# EAGLE design _Inverter16Smd (EAGLE 7.3.0)
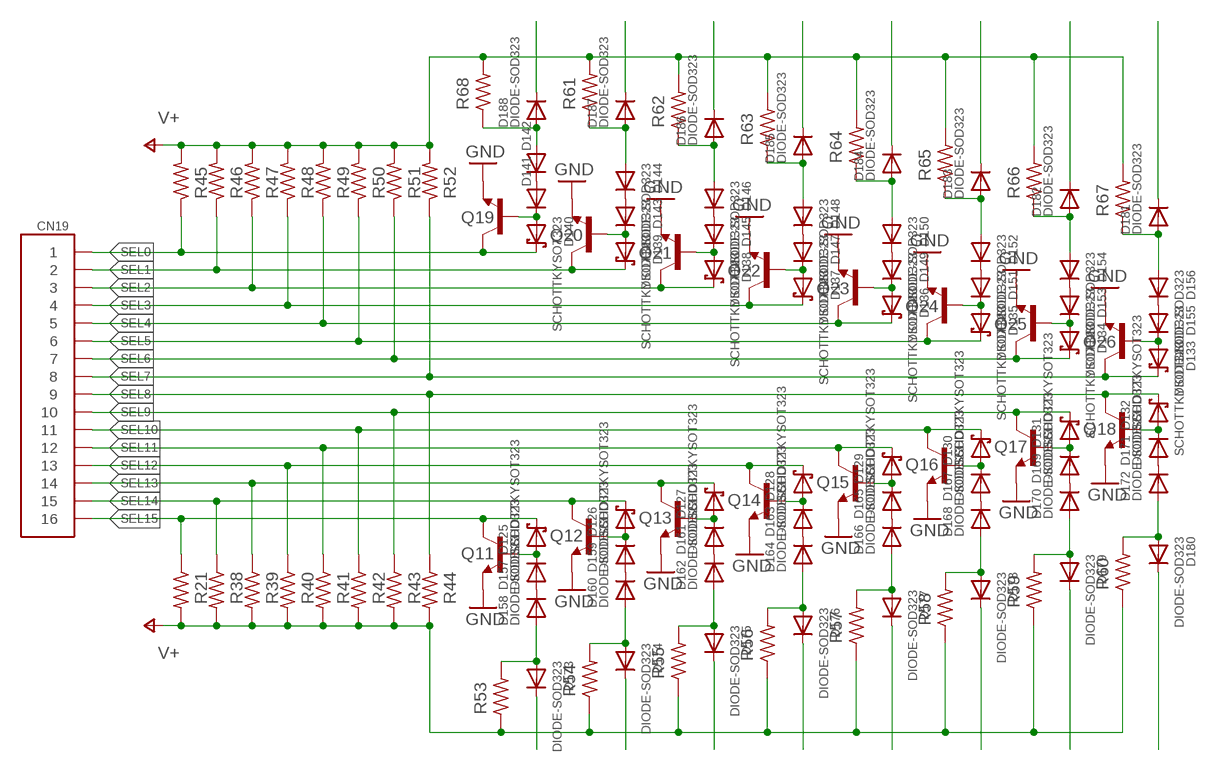
[diagram p0: schematic, sheet 1]

## Parts
CN19  HD16  [HD16]
D125  SCHOTTKYSOT323  [SOT23]
D126  SCHOTTKYSOT323  [SOT23]
D127  SCHOTTKYSOT323  [SOT23]
D128  SCHOTTKYSOT323  [SOT23]
D129  SCHOTTKYSOT323  [SOT23]
D130  SCHOTTKYSOT323  [SOT23]
D131  SCHOTTKYSOT323  [SOT23]
D132  SCHOTTKYSOT323  [SOT23]
D133  SCHOTTKYSOT323  [SOT23]
D134  SCHOTTKYSOT323  [SOT23]
D135  SCHOTTKYSOT323  [SOT23]
D136  SCHOTTKYSOT323  [SOT23]
D137  SCHOTTKYSOT323  [SOT23]
D138  SCHOTTKYSOT323  [SOT23]
D139  SCHOTTKYSOT323  [SOT23]
D140  SCHOTTKYSOT323  [SOT23]
D141  DIODE-SOD323  [SOD323F]
D142  DIODE-SOD323  [SOD323F]
D143  DIODE-SOD323  [SOD323F]
D144  DIODE-SOD323  [SOD323F]
D145  DIODE-SOD323  [SOD323F]
D146  DIODE-SOD323  [SOD323F]
D147  DIODE-SOD323  [SOD323F]
D148  DIODE-SOD323  [SOD323F]
D149  DIODE-SOD323  [SOD323F]
D150  DIODE-SOD323  [SOD323F]
D151  DIODE-SOD323  [SOD323F]
D152  DIODE-SOD323  [SOD323F]
D153  DIODE-SOD323  [SOD323F]
D154  DIODE-SOD323  [SOD323F]
D155  DIODE-SOD323  [SOD323F]
D156  DIODE-SOD323  [SOD323F]
D157  DIODE-SOD323  [SOD323F]
D158  DIODE-SOD323  [SOD323F]
D159  DIODE-SOD323  [SOD323F]
D160  DIODE-SOD323  [SOD323F]
D161  DIODE-SOD323  [SOD323F]
D162  DIODE-SOD323  [SOD323F]
D163  DIODE-SOD323  [SOD323F]
D164  DIODE-SOD323  [SOD323F]
D165  DIODE-SOD323  [SOD323F]
D166  DIODE-SOD323  [SOD323F]
D167  DIODE-SOD323  [SOD323F]
D168  DIODE-SOD323  [SOD323F]
D169  DIODE-SOD323  [SOD323F]
D170  DIODE-SOD323  [SOD323F]
D171  DIODE-SOD323  [SOD323F]
D172  DIODE-SOD323  [SOD323F]
D173  DIODE-SOD323  [SOD323F]
D174  DIODE-SOD323  [SOD323F]
D175  DIODE-SOD323  [SOD323F]
D176  DIODE-SOD323  [SOD323F]
D177  DIODE-SOD323  [SOD323F]
D178  DIODE-SOD323  [SOD323F]
D179  DIODE-SOD323  [SOD323F]
D180  DIODE-SOD323  [SOD323F]
D181  DIODE-SOD323  [SOD323F]
D182  DIODE-SOD323  [SOD323F]
D183  DIODE-SOD323  [SOD323F]
D184  DIODE-SOD323  [SOD323F]
D185  DIODE-SOD323  [SOD323F]
D186  DIODE-SOD323  [SOD323F]
D187  DIODE-SOD323  [SOD323F]
D188  DIODE-SOD323  [SOD323F]
Q11  BC547-SOT23  [SOT23]
Q12  BC547-SOT23  [SOT23]
Q13  BC547-SOT23  [SOT23]
Q14  BC547-SOT23  [SOT23]
Q15  BC547-SOT23  [SOT23]
Q16  BC547-SOT23  [SOT23]
Q17  BC547-SOT23  [SOT23]
Q18  BC547-SOT23  [SOT23]
Q19  BC547-SOT23  [SOT23]
Q20  BC547-SOT23  [SOT23]
Q21  BC547-SOT23  [SOT23]
Q22  BC547-SOT23  [SOT23]
Q23  BC547-SOT23  [SOT23]
Q24  BC547-SOT23  [SOT23]
Q25  BC547-SOT23  [SOT23]
Q26  BC547-SOT23  [SOT23]
R21  R-0805  [R0805]
R38  R-0805  [R0805]
R39  R-0805  [R0805]
R40  R-0805  [R0805]
R41  R-0805  [R0805]
R42  R-0805  [R0805]
R43  R-0805  [R0805]
R44  R-0805  [R0805]
R45  R-0805  [R0805]
R46  R-0805  [R0805]
R47  R-0805  [R0805]
R48  R-0805  [R0805]
R49  R-0805  [R0805]
R50  R-0805  [R0805]
R51  R-0805  [R0805]
R52  R-0805  [R0805]
R53  R-0805  [R0805]
R54  R-0805  [R0805]
R55  R-0805  [R0805]
R56  R-0805  [R0805]
R57  R-0805  [R0805]
R58  R-0805  [R0805]
R59  R-0805  [R0805]
R60  R-0805  [R0805]
R61  R-0805  [R0805]
R62  R-0805  [R0805]
R63  R-0805  [R0805]
R64  R-0805  [R0805]
R65  R-0805  [R0805]
R66  R-0805  [R0805]
R67  R-0805  [R0805]
R68  R-0805  [R0805]

## Nets
GND: Q11.2(E) Q12.2(E) Q13.2(E) Q14.2(E) Q15.2(E) Q16.2(E) Q17.2(E) Q18.2(E) Q19.2(E) Q20.2(E) Q21.2(E) Q22.2(E) Q23.2(E) Q24.2(E) Q25.2(E) Q26.2(E)
N$25: D125.1(A) D157.C Q11.1(B)
N$26: D126.1(A) D159.C Q12.1(B)
N$27: D127.1(A) D161.C Q13.1(B)
N$28: D128.1(A) D163.C Q14.1(B)
N$29: D129.1(A) D165.C Q15.1(B)
N$30: D130.1(A) D167.C Q16.1(B)
N$31: D131.1(A) D169.C Q17.1(B)
N$32: D132.1(A) D171.C Q18.1(B)
N$33: D140.1(A) D141.C Q19.1(B)
N$34: D139.1(A) D143.C Q20.1(B)
N$35: D138.1(A) D145.C Q21.1(B)
N$36: D137.1(A) D147.C Q22.1(B)
N$37: D136.1(A) D149.C Q23.1(B)
N$44: D135.1(A) D151.C Q24.1(B)
N$45: D134.1(A) D153.C Q25.1(B)
N$46: D133.1(A) D155.C Q26.1(B)
N$49: D141.A D142.C
N$50: D143.A D144.C
N$51: D145.A D146.C
N$52: D147.A D148.C
N$53: D149.A D150.C
N$54: D151.A D152.C
N$55: D153.A D154.C
N$56: D155.A D156.C
N$57: D157.A D158.C
N$58: D159.A D160.C
N$59: D161.A D162.C
N$60: D163.A D164.C
N$61: D165.A D166.C
N$62: D167.A D168.C
N$63: D169.A D170.C
N$64: D171.A D172.C
N$65: D158.A D173.A R53.2
N$66: D160.A D174.A R54.2
N$67: D162.A D175.A R55.2
N$68: D164.A D176.A R56.2
N$69: D166.A D177.A R57.2
N$70: D168.A D178.A R58.2
N$71: D170.A D179.A R59.2
N$72: D172.A D180.A R60.2
N$73: D156.A D181.A R67.1
N$74: D154.A D182.A R66.1
N$75: D152.A D183.A R65.1
N$76: D150.A D184.A R64.1
N$77: D148.A D185.A R63.1
N$78: D146.A D186.A R62.1
N$79: D144.A D187.A R61.1
N$80: D180.C
N$81: D179.C
N$82: D178.C
N$83: D177.C
N$84: D176.C
N$85: D175.C
N$86: D174.C
N$87: D173.C
N$88: D181.C
N$89: D142.A D188.A R68.1
N$90: D182.C
N$91: D183.C
N$92: D184.C
N$93: D185.C
N$94: D186.C
N$95: D187.C
N$96: D188.C
SEL0: CN19.P$1 D140.3(C) Q19.3(C) R45.1
SEL1: CN19.P$2 D139.3(C) Q20.3(C) R46.1
SEL2: CN19.P$3 D138.3(C) Q21.3(C) R47.1
SEL3: CN19.P$4 D137.3(C) Q22.3(C) R48.1
SEL4: CN19.P$5 D136.3(C) Q23.3(C) R49.1
SEL5: CN19.P$6 D135.3(C) Q24.3(C) R50.1
SEL6: CN19.P$7 D134.3(C) Q25.3(C) R51.1
SEL7: CN19.P$8 D133.3(C) Q26.3(C) R52.1
SEL8: CN19.P$9 D132.3(C) Q18.3(C) R44.1
SEL9: CN19.P$10 D131.3(C) Q17.3(C) R43.1
SEL10: CN19.P$11 D130.3(C) Q16.3(C) R42.1
SEL11: CN19.P$12 D129.3(C) Q15.3(C) R41.1
SEL12: CN19.P$13 D128.3(C) Q14.3(C) R40.1
SEL13: CN19.P$14 D127.3(C) Q13.3(C) R39.1
SEL14: CN19.P$15 D126.3(C) Q12.3(C) R38.1
SEL15: CN19.P$16 D125.3(C) Q11.3(C) R21.1
V+: R21.2 R38.2 R39.2 R40.2 R41.2 R42.2 R43.2 R44.2 R45.2 R46.2 R47.2 R48.2 R49.2 R50.2 R51.2 R52.2 R53.1 R54.1 R55.1 R56.1 R57.1 R58.1 R59.1 R60.1 R61.2 R62.2 R63.2 R64.2 R65.2 R66.2 R67.2 R68.2

## Library data of the parts
CN19 = SmallRoomLabs_ConSwitch:HD16
D125-D140 = SmallRoomLabs_Semiconductor:SCHOTTKY
D141-D188 = SmallRoomLabs_Semiconductor:DIODE
Q11-Q26 = SmallRoomLabs_Semiconductor:BC547
R21 R38-R68 = SmallRoomLabs_Discrete:R

## Board
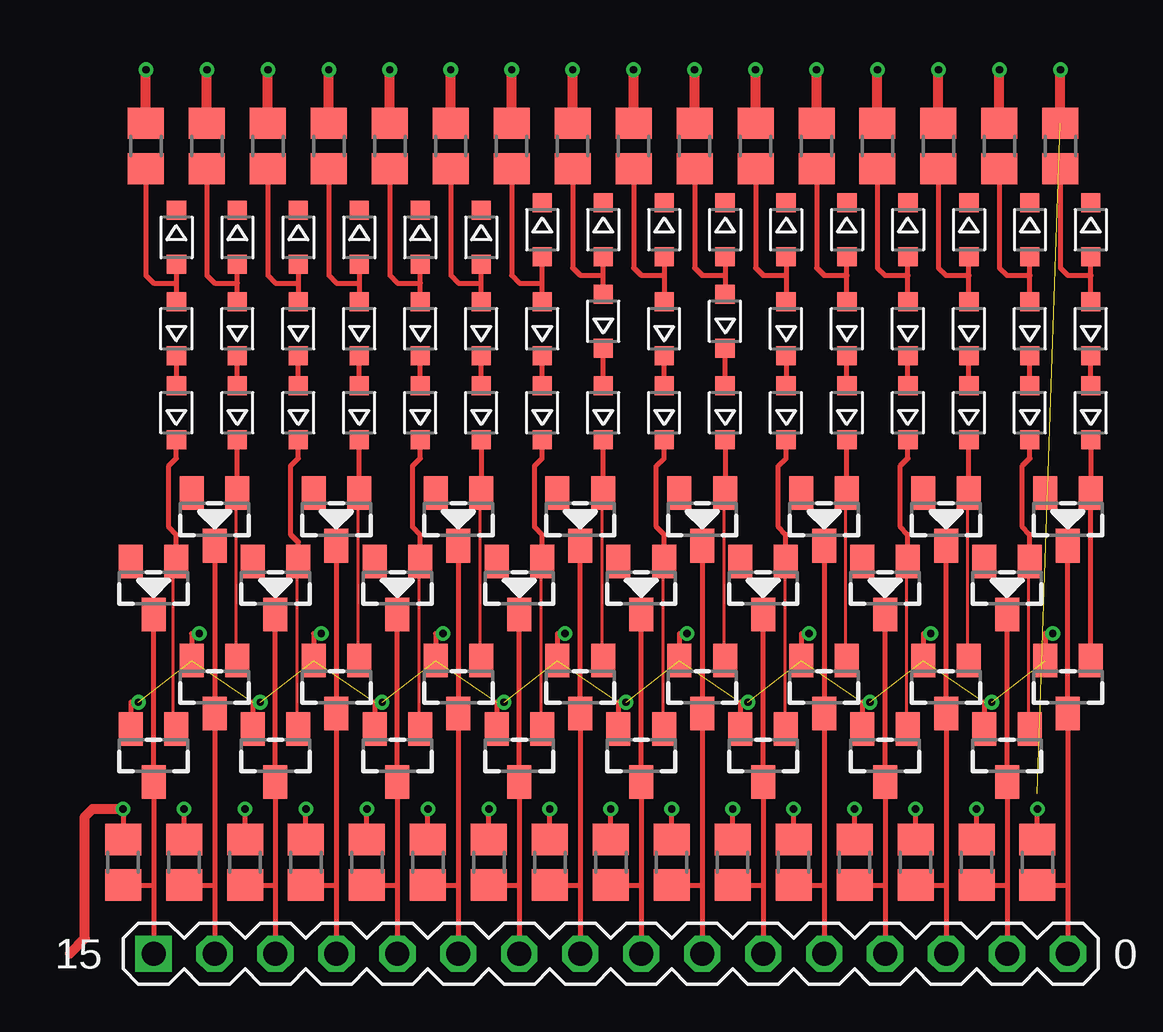
[diagram p1: board, top side]
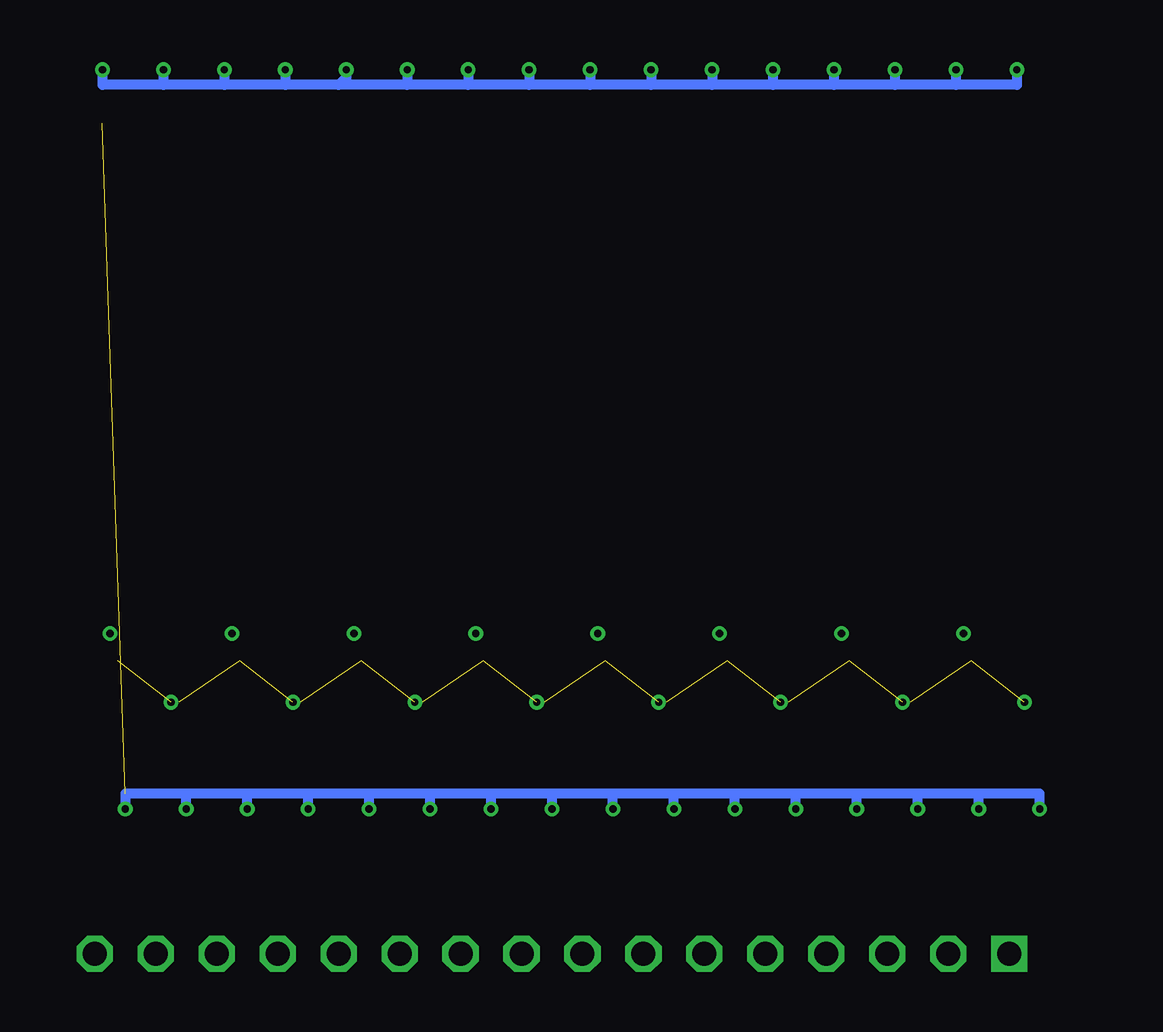
[diagram p2: board, bottom side, seen from below]

No outline drawn. Coordinates in mm, seen from the top.
Copper layers (1*16): Top 0.035mm / dielectric 1.5mm / Bottom 0.035mm
Design rules "dirt_cheap_dirty_boards.v1": minimum track width 5mil, minimum drill 12mil, track to track 5mil, track to pad 5mil, pad to pad 5mil, via to via 5mil, smd to smd 0mil, copper to edge 10mil, drill to drill 10mil, minimum pad ring 10mil, minimum via ring 6mil, stop-mask expansion 2mil, vias tented up to drill 25mil, thermal gap 10mil

### Footprints (pad centres in the part's own frame; a part is rotated, then mirrored left to right if it is on the bottom)
HD16 = drill 1 square: P$1 -19.05,0 | drill 1 octagon: P$2 -16.51,0; P$3 -13.97,0; P$4 -11.43,0; P$5 -8.89,0; P$6 -6.35,0; P$7 -3.81,0; P$8 -1.27,0; P$9 1.27,0; P$10 3.81,0; P$11 6.35,0; P$12 8.89,0; P$13 11.43,0; P$14 13.97,0; P$15 16.51,0; P$16 19.05,0
SOT23 = smd 1 x 1.4: 1 -0.95,-1.1; 2 0.95,-1.1; 3 0,1.1
SOD323F = smd 0.8 x 0.8: A 1.125,0; C -1.125,0
R0805 = smd 1.3 x 1.5: 1 -0.95,0; 2 0.95,0

### Placement (x,y rotation side)
CN19  77.47,1.91 0 top
D125  96.52,20 180 top
D126  93.98,17.14 180 top
D127  91.44,20 180 top
D128  88.9,17.14 180 top
D129  86.36,20 180 top
D130  83.82,17.14 180 top
D131  81.28,20 180 top
D132  78.74,17.14 180 top
D133  76.2,20 180 top
D134  73.66,17.14 180 top
D135  71.12,20 180 top
D136  68.58,17.14 180 top
D137  66.04,20 180 top
D138  63.5,17.14 180 top
D139  60.96,20 180 top
D140  58.42,17.14 180 top
D141  59.37,24.45 90 top
D142  59.37,27.94 90 top
D143  61.91,24.45 90 top
D144  61.91,27.94 90 top
D145  64.45,24.45 90 top
D146  64.45,27.94 90 top
D147  66.99,24.45 90 top
D148  66.99,27.94 90 top
D149  69.53,24.45 90 top
D150  69.53,27.94 90 top
D151  72.07,24.45 90 top
D152  72.07,27.94 90 top
D153  74.61,24.45 90 top
D154  74.61,27.94 90 top
D155  77.15,24.45 90 top
D156  77.15,28.26 90 top
D157  97.47,24.45 90 top
D158  97.47,27.94 90 top
D159  94.93,24.45 90 top
D160  94.93,27.94 90 top
D161  92.39,24.45 90 top
D162  92.39,27.94 90 top
D163  89.85,24.45 90 top
D164  89.85,27.94 90 top
D165  87.31,24.45 90 top
D166  87.31,27.94 90 top
D167  84.77,24.45 90 top
D168  84.77,27.94 90 top
D169  82.23,24.45 90 top
D170  82.23,28.26 90 top
D171  79.69,24.45 90 top
D172  79.69,27.94 90 top
D173  97.47,32.07 270 top
D174  94.93,32.07 270 top
D175  92.39,32.07 270 top
D176  89.85,32.07 270 top
D177  87.31,32.07 270 top
D178  84.77,32.07 270 top
D179  82.23,32.07 270 top
D180  79.69,32.07 270 top
D181  77.15,32.07 270 top
D182  74.61,32.07 270 top
D183  72.07,31.75 270 top
D184  69.53,31.75 270 top
D185  66.99,31.75 270 top
D186  64.45,31.75 270 top
D187  61.91,31.75 270 top
D188  59.37,31.75 270 top
Q11  96.52,13.02 180 top
Q12  93.98,10.16 180 top
Q13  91.44,13.02 180 top
Q14  88.9,10.16 180 top
Q15  86.36,13.02 180 top
Q16  83.82,10.16 180 top
Q17  81.28,13.02 180 top
Q18  78.74,10.16 180 top
Q19  58.42,10.16 180 top
Q20  60.96,13.02 180 top
Q21  63.5,10.16 180 top
Q22  66.04,13.02 180 top
Q23  68.58,10.16 180 top
Q24  71.12,13.02 180 top
Q25  73.66,10.16 180 top
Q26  76.2,13.02 180 top
R21  95.25,5.71 90 top
R38  92.71,5.71 90 top
R39  90.17,5.71 90 top
R40  87.63,5.71 90 top
R41  85.09,5.71 90 top
R42  82.55,5.71 90 top
R43  80.01,5.71 90 top
R44  77.47,5.71 90 top
R45  57.15,5.71 90 top
R46  59.69,5.71 90 top
R47  62.23,5.71 90 top
R48  64.77,5.71 90 top
R49  67.31,5.71 90 top
R50  69.85,5.71 90 top
R51  72.39,5.71 90 top
R52  74.93,5.71 90 top
R53  96.2,35.56 270 top
R54  93.66,35.56 270 top
R55  91.12,35.56 270 top
R56  88.58,35.56 270 top
R57  86.04,35.56 270 top
R58  83.5,35.56 270 top
R59  80.96,35.56 270 top
R60  78.42,35.56 270 top
R61  60.64,35.56 90 top
R62  63.18,35.56 90 top
R63  65.72,35.56 90 top
R64  68.26,35.56 90 top
R65  70.8,35.56 90 top
R66  73.34,35.56 90 top
R67  75.88,35.56 90 top
R68  58.1,35.56 90 top

### Tracks (layer width: path | path; a pad name or v marks a point on that pad's centre or on a via)
GND  (via drill 0.3)  (15 unrouted)
  Top 0.203: v57.78,12.38 57.47,12.38 Q19.2 | v62.87,12.38 62.55,12.38 Q21.2 | v67.94,12.38 67.63,12.38 Q23.2 | v73.03,12.38 72.71,12.38 Q25.2 | v78.11,12.38 77.79,12.38 Q18.2 | v83.19,12.38 82.87,12.38 Q16.2 | v88.27,12.38 87.95,12.38 Q14.2 | v93.34,12.38 93.03,12.38 Q12.2 | v95.89,15.24 95.57,15.24 Q11.2 | v90.81,15.24 90.49,15.24 Q13.2 | v60.33,15.24 60.01,15.24 Q20.2 | v65.41,15.24 65.09,15.24 Q22.2 | v70.48,15.24 70.17,15.24 Q24.2 | v75.56,15.24 75.25,15.24 Q26.2 | v80.64,15.24 80.33,15.24 Q17.2 | v85.72,15.24 85.41,15.24 Q15.2
N$25
  Top 0.203: Q11.1 D125.1 D157.C
N$26
  Top 0.127: Q12.1 94.87,11.3 94.87,18.22 D126.1
  Top 0.203: D126.1 94.93,19.37 94.61,19.68 94.61,22.23 94.93,22.54 D159.C
N$27
  Top 0.127: Q13.1 92.33,14.16 92.33,21.02 D127.1
  Top 0.203: D127.1 D161.C
N$28
  Top 0.127: Q14.1 89.79,11.3 89.79,18.22 D128.1
  Top 0.203: D128.1 89.85,19.37 89.53,19.68 89.53,22.23 89.85,22.54 D163.C
N$29
  Top 0.127: Q15.1 87.25,14.16 87.25,21.02 D129.1
  Top 0.203: D129.1 D165.C
N$30
  Top 0.127: Q16.1 84.71,11.3 84.71,18.22 D130.1
  Top 0.203: D130.1 84.77,19.37 84.45,19.68 84.45,22.23 84.77,22.54 D167.C
N$31
  Top 0.127: Q17.1 82.17,14.16 82.17,21.02 D131.1
  Top 0.203: D169.C D131.1
N$32
  Top 0.127: Q18.1 79.63,11.3 79.63,18.22 D132.1
  Top 0.203: D132.1 79.69,19.37 79.38,19.68 79.38,22.23 79.69,22.54 D171.C
N$33
  Top 0.127: Q19.1 59.21,11.27 59.21,18.1 D140.1
  Top 0.203: D140.1 59.37,19.37 59.05,19.68 59.05,22.23 59.37,22.54 D141.C
N$34
  Top 0.127: Q20.1 61.85,14.16 61.85,21.02 D139.1
  Top 0.203: D139.1 D143.C
N$35
  Top 0.127: Q21.1 64.39,11.3 64.39,18.22 D138.1
  Top 0.203: D138.1 64.45,19.05 64.14,19.37 64.14,22.23 64.45,22.54 D145.C
N$36
  Top 0.127: Q22.1 66.93,14.16 66.93,21.02 D137.1
  Top 0.203: D137.1 D147.C
N$37
  Top 0.127: Q23.1 69.47,11.3 69.47,18.22 D136.1
  Top 0.203: D136.1 69.53,19.37 69.22,19.68 69.22,22.23 69.53,22.54 D149.C
N$44
  Top 0.127: Q24.1 72.01,14.16 72.01,21.02 D135.1
  Top 0.203: D151.C D135.1
N$45
  Top 0.127: Q25.1 74.55,11.3 74.55,18.22 D134.1
  Top 0.203: D134.1 74.61,19.37 74.3,19.68 74.3,22.23 74.61,22.54 D153.C
N$46
  Top 0.127: Q26.1 77.09,14.16 77.09,21.02 D133.1
  Top 0.203: D133.1 D155.C
N$49
  Top 0.203: D142.C D141.A
N$50
  Top 0.203: D143.A D144.C
N$51
  Top 0.203: D145.A D146.C
N$52
  Top 0.203: D147.A D148.C
N$53
  Top 0.203: D149.A D150.C
N$54
  Top 0.203: D151.A D152.C
N$55
  Top 0.203: D153.A D154.C
N$56
  Top 0.203: D155.A D156.C
N$57
  Top 0.203: D157.A D158.C
N$58
  Top 0.203: D159.A D160.C
N$59
  Top 0.203: D161.A D162.C
N$60
  Top 0.203: D163.A D164.C
N$61
  Top 0.203: D165.A D166.C
N$62
  Top 0.203: D168.C D167.A
N$63
  Top 0.203: D169.A D170.C
N$64
  Top 0.203: D171.A D172.C
N$65
  Top 0.203: D158.A 97.47,30.16 | 97.47,30.16 D173.A | R53.2 96.2,30.48 96.52,30.16 97.47,30.16
N$66
  Top 0.203: D160.A 94.93,30.16 | 94.93,30.16 D174.A | R54.2 93.66,30.48 93.98,30.16 94.93,30.16
N$67
  Top 0.203: D162.A 92.39,30.16 | 92.39,30.16 D175.A | R55.2 91.12,30.48 91.44,30.16 92.39,30.16
N$68
  Top 0.203: D164.A 89.85,30.16 | 89.85,30.16 D176.A | R56.2 88.58,30.48 88.9,30.16 89.85,30.16
N$69
  Top 0.203: D166.A 87.31,30.16 | 87.31,30.16 D177.A | R57.2 86.04,30.48 86.36,30.16 87.31,30.16
N$70
  Top 0.203: D178.A 84.77,30.16 | 84.77,30.16 D168.A | R58.2 83.5,30.48 83.82,30.16 84.77,30.16
N$71
  Top 0.203: D179.A 82.23,30.16 | 82.23,30.16 D170.A | R59.2 80.96,30.48 81.28,30.16 82.23,30.16
N$72
  Top 0.203: R60.2 78.42,30.48 78.74,30.16 79.69,30.16 | D180.A 79.69,30.16 | 79.69,30.16 D172.A
N$73
  Top 0.203: D156.A 77.15,30.16 | 77.15,30.16 D181.A | R67.1 75.88,30.48 76.2,30.16 77.15,30.16
N$74
  Top 0.203: D154.A 74.61,29.84 | 74.61,29.84 D182.A | R66.1 73.34,30.16 73.66,29.84 74.61,29.84
N$75
  Top 0.203: D152.A 72.07,29.84 | 72.07,29.84 D183.A | R65.1 70.8,30.16 71.12,29.84 72.07,29.84
N$76
  Top 0.203: D150.A 69.53,29.84 | 69.53,29.84 D184.A | R64.1 68.26,30.16 68.58,29.84 69.53,29.84
N$77
  Top 0.203: R63.1 65.72,30.16 66.04,29.84 66.99,29.84 | D185.A 66.99,29.84 | 66.99,29.84 D148.A
N$78
  Top 0.203: D186.A 64.45,29.84 | 64.45,29.84 D146.A | R62.1 63.18,30.16 63.5,29.84 64.45,29.84
N$79
  Top 0.203: D144.A 61.91,29.84 | 61.91,29.84 D187.A | R61.1 60.64,30.16 60.96,29.84 61.91,29.84
N$89
  Top 0.203: D188.A 59.37,29.84 | 59.37,29.84 D142.A | R68.1 58.1,30.16 58.42,29.84 59.37,29.84
SEL0
  Top 0.203: 58.42,4.76 Q19.3 D140.3 | 58.42,4.76 CN19.P$1 | R45.1 58.42,4.76
SEL1
  Top 0.203: 60.96,4.76 Q20.3 D139.3 | 60.96,4.76 CN19.P$2 | R46.1 60.96,4.76
SEL2
  Top 0.203: 63.5,4.76 Q21.3 D138.3 | 63.5,4.76 CN19.P$3 | R47.1 63.5,4.76
SEL3
  Top 0.203: 66.04,4.76 Q22.3 D137.3 | 66.04,4.76 CN19.P$4 | R48.1 66.04,4.76
SEL4
  Top 0.203: 68.58,4.76 Q23.3 D136.3 | 68.58,4.76 CN19.P$5 | R49.1 68.58,4.76
SEL5
  Top 0.203: 71.12,4.76 Q24.3 D135.3 | 71.12,4.76 CN19.P$6 | R50.1 71.12,4.76
SEL6
  Top 0.203: 73.66,4.76 Q25.3 D134.3 | 73.66,4.76 CN19.P$7 | R51.1 73.66,4.76
SEL7
  Top 0.203: 76.2,4.76 Q26.3 D133.3 | 76.2,4.76 CN19.P$8 | R52.1 76.2,4.76
SEL8
  Top 0.203: 78.74,4.76 Q18.3 D132.3 | 78.74,4.76 CN19.P$9 | R44.1 78.74,4.76
SEL9
  Top 0.203: 81.28,4.76 Q17.3 D131.3 | 81.28,4.76 CN19.P$10 | R43.1 81.28,4.76
SEL10
  Top 0.203: 83.82,4.76 Q16.3 D130.3 | 83.82,4.76 CN19.P$11 | R42.1 83.82,4.76
SEL11
  Top 0.203: 86.36,4.76 Q15.3 D129.3 | 86.36,4.76 CN19.P$12 | R41.1 86.36,4.76
SEL12
  Top 0.203: 88.9,4.76 Q14.3 D128.3 | 88.9,4.76 CN19.P$13 | R40.1 88.9,4.76
SEL13
  Top 0.203: 91.44,4.76 Q13.3 D127.3 | 91.44,4.76 CN19.P$14 | R39.1 91.44,4.76
SEL14
  Top 0.203: 93.98,4.76 Q12.3 D126.3 | 93.98,4.76 CN19.P$15 | R38.1 93.98,4.76
SEL15
  Top 0.203: 96.52,4.76 Q11.3 D125.3 | 96.52,4.76 CN19.P$16 | R21.1 96.52,4.76
V+  (via drill 0.3)  (1 unrouted)
  Top 0.203: R21.2 v95.25,7.94 | v57.15,7.94 R45.2 | R46.2 v59.69,7.94 | R47.2 v62.23,7.94 | R48.2 v64.77,7.94 | R49.2 v67.31,7.94 | R50.2 v69.85,7.94 | R51.2 v72.39,7.94 | R52.2 v74.93,7.94 | R44.2 v77.47,7.94 | R43.2 v80.01,7.94 | R42.2 v82.55,7.94 | R41.2 v85.09,7.94 | R40.2 v87.63,7.94 | R39.2 v90.17,7.94 | R38.2 v92.71,7.94
  Top 0.406: 54.93,1.91 55.56,2.54 55.56,7.62 55.88,7.94 v57.15,7.94 | R54.1 v93.66,38.73 | R55.1 v91.12,38.73 | R56.1 v88.58,38.73 | R57.1 v86.04,38.73 | R58.1 v83.5,38.73 | R59.1 v80.96,38.73 | R60.1 v78.42,38.73 | R67.2 v75.88,38.73 | R66.2 v73.34,38.73 | R65.2 v70.8,38.73 | R64.2 v68.26,38.73 | R63.2 v65.72,38.73 | R62.2 v63.18,38.73 | R61.2 v60.64,38.73 | R68.2 v58.1,38.73 | R53.1 v96.2,38.73
  Bottom 0.406: 60.64,38.1 58.1,38.1 v58.1,38.73 | 60.64,38.1 63.18,38.1 | 63.18,38.1 65.72,38.1 | 65.72,38.1 68.26,38.1 | 68.26,38.1 70.8,38.1 | 70.8,38.1 73.34,38.1 | 73.34,38.1 75.88,38.1 | 75.88,38.1 78.42,38.1 | 78.42,38.1 80.96,38.1 | 80.96,38.1 83.5,38.1 | 83.5,38.1 86.36,38.1 | 86.36,38.1 88.58,38.1 | 88.58,38.1 91.12,38.1 | 91.12,38.1 93.66,38.1 | 93.66,38.1 96.2,38.1 v96.2,38.73 | v93.66,38.73 93.66,38.1 | v91.12,38.73 91.12,38.1 | v88.58,38.73 88.58,38.1 | v86.04,38.73 86.04,38.42 86.36,38.1 | v83.5,38.73 83.5,38.1 | v80.96,38.73 80.96,38.1 | v78.42,38.73 78.42,38.1 | v75.88,38.73 75.88,38.1 | v73.34,38.73 73.34,38.1 | v70.8,38.73 70.8,38.1 | v68.26,38.73 68.26,38.1 | v65.72,38.73 65.72,38.1 | v63.18,38.73 63.18,38.1 | v60.64,38.73 60.64,38.1 | v57.15,7.94 57.15,8.57 59.69,8.57 | 59.69,8.57 62.23,8.57 | 62.23,8.57 64.77,8.57 | 64.77,8.57 67.31,8.57 | 67.31,8.57 69.85,8.57 | 69.85,8.57 72.39,8.57 | 72.39,8.57 74.93,8.57 | 74.93,8.57 77.47,8.57 | 77.47,8.57 80.01,8.57 | 80.01,8.57 82.55,8.57 | 82.55,8.57 85.09,8.57 | 85.09,8.57 87.63,8.57 | 87.63,8.57 90.17,8.57 | 90.17,8.57 92.71,8.57 | 92.71,8.57 95.25,8.57 v95.25,7.94 | v92.71,7.94 92.71,8.57 | v90.17,7.94 90.17,8.57 | v87.63,7.94 87.63,8.57 | v85.09,7.94 85.09,8.57 | v82.55,7.94 82.55,8.57 | v80.01,7.94 80.01,8.57 | v77.47,7.94 77.47,8.57 | v74.93,7.94 74.93,8.57 | v72.39,7.94 72.39,8.57 | v69.85,7.94 69.85,8.57 | v67.31,7.94 67.31,8.57 | v64.77,7.94 64.77,8.57 | v62.23,7.94 62.23,8.57 | v59.69,7.94 59.69,8.57

### Text on the board
tPlace: 15 | 0